# EasyEDA Pro project PY32单片机版电池內阻测试仪.eprj, schematic PY32单片机版电池內阻测试仪
Create Date: 2023-05-11; Page Name: PY32单片机版电池內阻测试仪; Project Name: PY32单片机版电池內阻测试仪; Schematic Name: PY32单片机版电池內阻测试仪; Update Date: 2023-08-15; Company: 嘉立创EDA; Page Size: A4; Version: V1.0
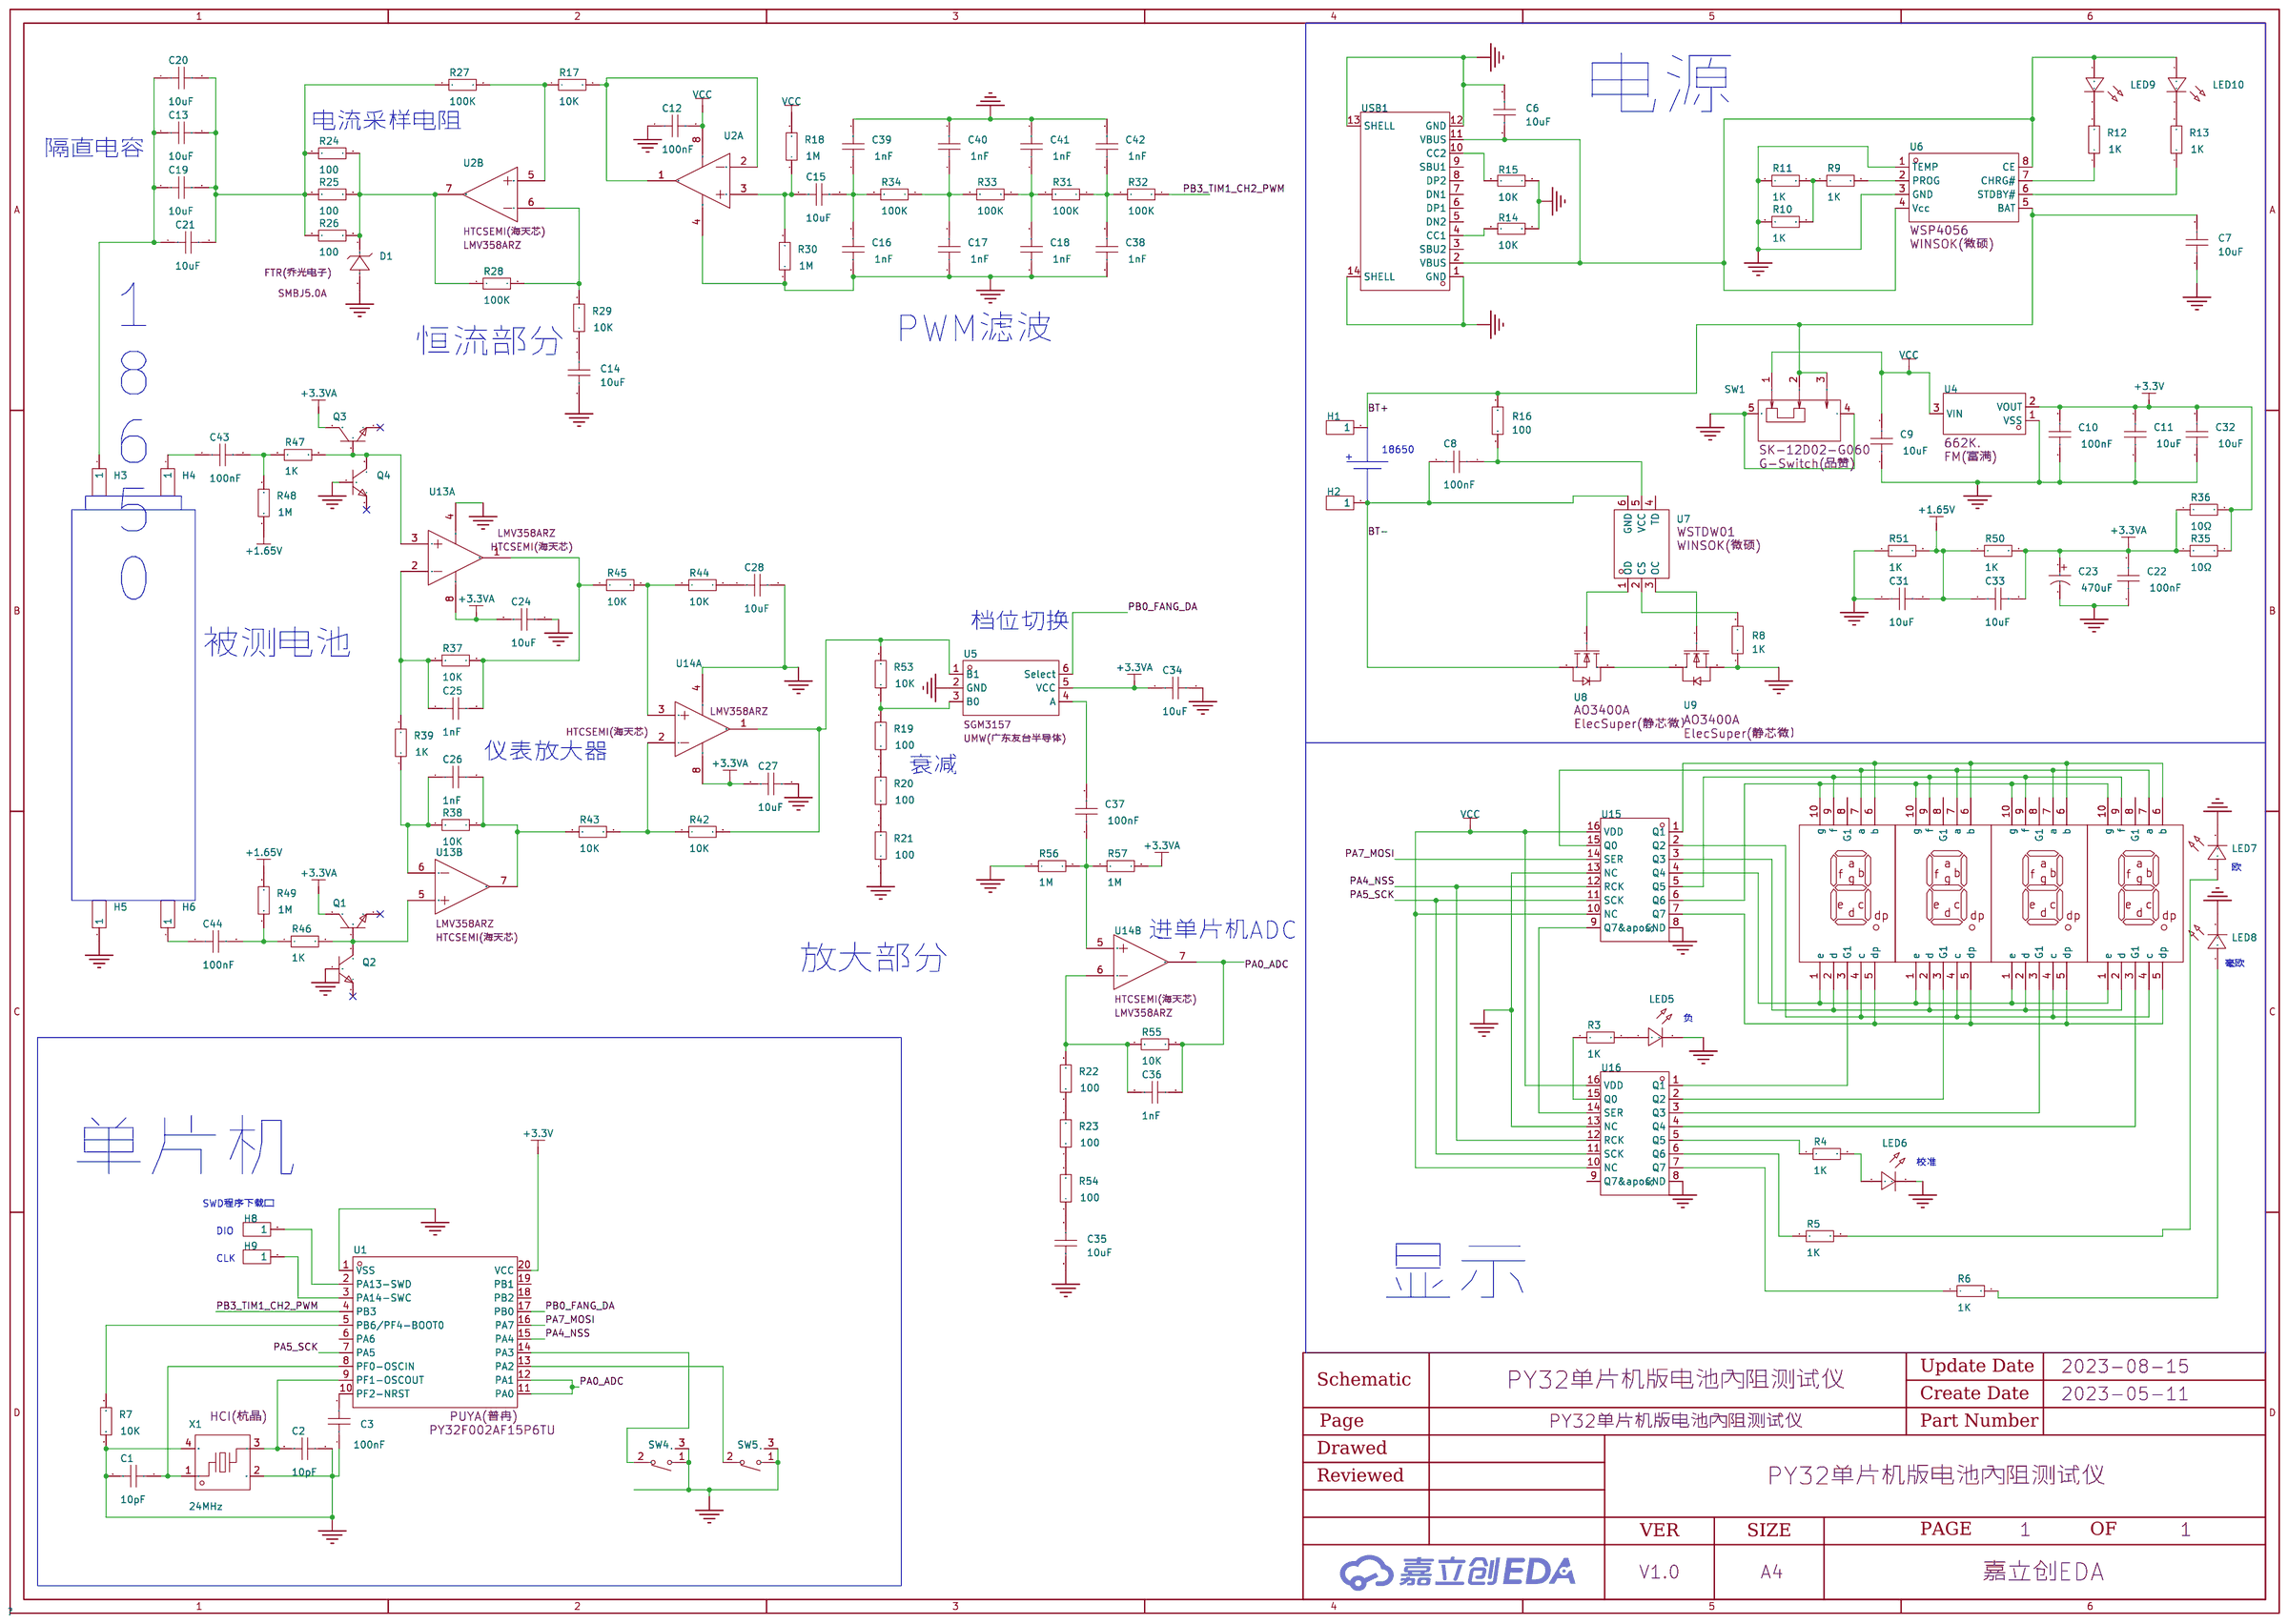
[diagram p0: schematic sheet]

## Parts
C1  10pF  [C0603]
C2  10pF  [C0603]
C3  100nF  [C0603]
C6  10uF  [C0603]
C7  10uF  [C0603]
C8  100nF  [C0603]
C9  10uF  [C0603]
C10  100nF  [C0603]
C11  10uF  [C0603]
C12  100nF  [C0603]
C13  10uF  [C0603]
C14  10uF  [C0603]
C15  10uF  [C0603]
C16  1nF  [C0603]
C17  1nF  [C0603]
C18  1nF  [C0603]
C19  10uF  [C0603]
C20  10uF  [C0603]
C21  10uF  [C0603]
C22  100nF  [C0603]
C23  470uF  [CAP-TH_BD8.0-P3.50-D0.6-FD]
C24  10uF  [C0603]
C25  1nF  [C0603]
C26  1nF  [C0603]
C27  10uF  [C0603]
C28  10uF  [C0603]
C31  10uF  [C0603]
C32  10uF  [C0603]
C33  10uF  [C0603]
C34  10uF  [C0603]
C35  10uF  [C0603]
C36  1nF  [C0603]
C37  100nF  [C0603]
C38  1nF  [C0603]
C39  1nF  [C0603]
C40  1nF  [C0603]
C41  1nF  [C0603]
C42  1nF  [C0603]
C43  100nF  [C1206]
C44  100nF  [C1206]
D1  SMBJ5.0A  [SMB_L4.3-W3.6-LS5.3-RD]
H1  -  [HDR-TH_1P-V-M_XKB_X4611WV-01I-C28D40]
H2  -  [HDR-TH_1P-V-M_XKB_X4611WV-01I-C28D40]
H3  -  [HDR-TH_1P-V-M_XKB_X4611WV-01I-C28D40]
H4  -  [HDR-TH_1P-V-M_XKB_X4611WV-01I-C28D40]
H5  -  [HDR-TH_1P-V-M_XKB_X4611WV-01I-C28D40]
H6  -  [HDR-TH_1P-V-M_XKB_X4611WV-01I-C28D40]
H8  -  [HDR-TH_1P-V-M_XKB_X4611WV-01I-C28D40]
H9  -  [HDR-TH_1P-V-M_XKB_X4611WV-01I-C28D40]
LED5  -  [LED_TH-3mm]
LED6  -  [LED_TH-3mm]
LED7  -  [LED_TH-3mm]
LED8  -  [LED_TH-3mm]
LED9  -  [LED_TH-3mm]
LED10  -  [LED_TH-3mm]
LED11  SM410561N  [LED-SEG-TH_10P-L12.7-W19.0-P2.54-S15.24-BL]
LED12  SM410561N  [LED-SEG-TH_10P-L12.7-W19.0-P2.54-S15.24-BL]
LED13  SM410561N  [LED-SEG-TH_10P-L12.7-W19.0-P2.54-S15.24-BL]
LED14  SM410561N  [LED-SEG-TH_10P-L12.7-W19.0-P2.54-S15.24-BL]
Q1  SS8050  [SOT-23-3_L2.9-W1.3-P1.90-LS2.4-BR]
Q2  SS8050  [SOT-23-3_L2.9-W1.3-P1.90-LS2.4-BR]
Q3  SS8050  [SOT-23-3_L2.9-W1.3-P1.90-LS2.4-BR]
Q4  SS8050  [SOT-23-3_L2.9-W1.3-P1.90-LS2.4-BR]
R3  1K  [R0603]
R4  1K  [R0603]
R5  1K  [R0603]
R6  1K  [R0603]
R7  10K  [R0603]
R8  1K  [R0603]
R9  1K  [R0603]
R10  1K  [R0603]
R11  1K  [R0603]
R12  1K  [R0603]
R13  1K  [R0603]
R14  10K  [R0603]
R15  10K  [R0603]
R16  100  [R0603]
R17  10K  [R0603]
R18  1M  [R0603]
R19  100  [R0603]
R20  100  [R0603]
R21  100  [R0603]
R22  100  [R0603]
R23  100  [R0603]
R24  100  [R0603]
R25  100  [R0603]
R26  100  [R0603]
R27  100K  [R0603]
R28  100K  [R0603]
R29  10K  [R0603]
R30  1M  [R0603]
R31  100K  [R0603]
R32  100K  [R0603]
R33  100K  [R0603]
R34  100K  [R0603]
R35  10Ω  [R0603]
R36  10Ω  [R0603]
R37  10K  [R0603]
R38  10K  [R0603]
R39  1K  [R0603]
R42  10K  [R0603]
R43  10K  [R0603]
R44  10K  [R0603]
R45  10K  [R0603]
R46  1K  [R0603]
R47  1K  [R0603]
R48  1M  [R0603]
R49  1M  [R0603]
R50  1K  [R0603]
R51  1K  [R0603]
R53  10K  [R0603]
R54  100  [R0603]
R55  10K  [R0603]
R56  1M  [R0603]
R57  1M  [R0603]
SW1  SK-12D02-G060  [SW-TH_SK-12D02-G060]
SW4  HX TS4538B3J 250gf  [SW-TH_TS4538B3J]
SW5  HX TS4538B3J 250gf  [SW-TH_TS4538B3J]
U1  PY32F002AF15P6TU  [TSSOP-20_L6.5-W4.4-P0.65-LS6.4-BL]
U2  LMV358ARZ  [SOP-8_L4.9-W3.9-P1.27-LS6.0-BL]  (sections 1,2)
U4  662K.  [SOT-23-3_L2.9-W1.3-P1.90-LS2.4-BR]
U5  SGM3157  [SC-70-6_L2.2-W1.3-P0.65-LS2.1-BL]
U6  WSP4056  [SOP-8_L5.1-W3.9-P1.27-LS6.0-BL]
U7  WSTDW01  [SOT-23-6_L2.9-W1.6-P0.95-LS2.8-BR]
U8  AO3400A  [SOT-23-3_L3.0-W1.6-P1.90-LS2.8-BR]
U9  AO3400A  [SOT-23-3_L3.0-W1.6-P1.90-LS2.8-BR]
U13  LMV358ARZ  [SOP-8_L4.9-W3.9-P1.27-LS6.0-BL]  (sections 1,2)
U14  LMV358ARZ  [SOP-8_L4.9-W3.9-P1.27-LS6.0-BL]  (sections 1,2)
U15  74HC595D.  [SOP-16_L9.9-W3.9-P1.27-LS6.0-BL]
U16  74HC595D.  [SOP-16_L9.9-W3.9-P1.27-LS6.0-BL]
USB1  TYPE-C 16PIN 2MD(073)  [USB-C-SMD_TYPE-C-6PIN-2MD-073]
X1  24MHz  [CRYSTAL-SMD_4P-L3.2-W2.5-BL]

## Library data of the parts
C1-C3 C6-C22 C24-C28 C31-C42 = CAP_0603: Supplier Footprint: 0603
C23 = KM477M016F12RR0VH2FP0: 容值:470uF;精度:±20%;额定电压:16V;; LCSC Part Name: 470uF ±20% 16V; Supplier Part: C28067; Manufacturer: CX(承兴); Supplier Footprint: 插件,D8xL12mm; JLCPCB Part Class: Extended Part; Datasheet: https://atta.szlcsc.com/upload/public/pdf/source/20211027/06D6BA3719C264B639DC286D935D03EA.pdf; Supplier: LCSC; Tolerance: ±20%; Rated Voltage: 16V; φD: 8mm; L: 12mm; Lead Spacing: 3.5mm; Lifetime @ Temp: 2000hrs@105℃
C43 C44 = FM31X104K451EEG: 容值:100nF;精度:±10%;额定电压:450V;材质(温度系数):X7R;; LCSC Part Name: 100nF ±10% 450V; Supplier Part: C784091; Manufacturer: PSA(信昌电陶); Supplier Footprint: 1206; JLCPCB Part Class: Extended Part; Datasheet: https://atta.szlcsc.com/upload/public/pdf/source/20191129/C464973_650D2E1C0337226551311C911F3C07C2.pdf; Supplier: LCSC; Tolerance: ±10%; Voltage Rated: 450V; Temperature Coefficient: X7R
D1 = SMBJ5.0A_C693503: 极性:单向;反向截止电压(Vrwm):5V;击穿电压(最小值):6.4V;峰值脉冲电流(Ipp)@10/1000s:65.3A;最大钳位电压:9.2V;; LCSC Part Name: 单向 5V; Supplier Part: C693503; Manufacturer: FTR(乔光电子); Supplier Footprint: SMB(DO-214AA); JLCPCB Part Class: Extended Part; Datasheet: https://atta.szlcsc.com/upload/public/pdf/source/20200701/C693490_2A1922FF33BB98835C22E740F3EF18EC.pdf; Supplier: LCSC; Polarity: 单向; Reverse Stand-Off Voltage (Vrwm): 5V; Breakdown Voltage (Min): 6.4V; Peak Pulse Current (Ipp)@10/1000μs: 65.3A; Maximum Clamping Voltage: 9.2V
H1-H6 H8 H9 = HDR-M_2.54_1x1P: Supplier Part: C81276; Supplier Footprint: 插件; JLCPCB Part Class: Extended Part
LED5-LED10 = LED_TH-R_3mm: Supplier Footprint: 插件
LED11-LED14 = SM410561N: 数码管位数:1;数字/字母大小(英寸):0.56;LED极性:共阳;发光颜色:红色;; Supplier Part: C141368; Manufacturer: ARKLED(方舟); Supplier Footprint: 插件; JLCPCB Part Class: Extended Part; Datasheet: https://atta.szlcsc.com/upload/public/pdf/source/20171116/C141368_15108221487951123771.pdf; Supplier: LCSC; Number of Characters: 1; Digit/Alpha Size(inch): 0.56; LED Polarity: 共阳; Luminous Color: 红色
Q1-Q4 = SS8050_C5249676: Polarity NPN 耗散功率(W) 0.3 最大集电极电流(mA) 1500 集电极-基极电压（V） 40 饱和压降（V） 0.5 集电极/基极电流（mA） 800/80 最大工作频率(MHz) 100; Supplier Part: C5249676; Manufacturer: ElecSuper(静芯微）; Supplier Footprint: SOT-23; JLCPCB Part Class: Extended Part; Datasheet: https://atta.szlcsc.com/upload/public/pdf/source/20221109/25143ABAE3EF3AA2633DA047E92DED74.pdf; Supplier: LCSC
R3-R39 R42-R51 R53-R57 = Res_0603: Supplier Footprint: 0603
SW1 = SK-12D02-G060: 额定电流(DC):1A;额定电压(DC):24V;电路结构:单刀双掷;安装方式:卧插;机械寿命:1万次;开关颜色:黑色;; LCSC Part Name: 柄长6mm 卧插两档 滑动开关; Supplier Part: C2848884; Manufacturer: G-Switch(品赞); Supplier Footprint: 插件; JLCPCB Part Class: Extended Part; Datasheet: https://atta.szlcsc.com/upload/public/pdf/source/20210728/C2848884_C5B755598AC53A35BC19ACF540C1E5A5.pdf; Supplier: LCSC; Current Rating (DC): 1A; Voltage Rating (DC): 24V; Circuit: 单刀双掷; Mounting Style: 卧插; Mechanical Life: 1万次; Actuator Color: 黑色; Actuator Style: 矩形柱状; Pin Style: PC引脚; Operating Temperature: -25℃~+70℃; Switch Length: 8.6mm; Switch Width: 4.5mm; Switch Height: 10.5mm
SW4 SW5 = HX TS4538B3J 250gf: 机械寿命:-;; LCSC Part Name: 4.5*4.5*3.8mm 插件 轻触开关 不锈钢弹片 边三脚; Supplier Part: C5143652; Manufacturer: hanxia(韩下); Supplier Footprint: 插件; Datasheet: https://atta.szlcsc.com/upload/public/pdf/source/20220824/7E1C713E0EBD99A324597FCD97A4D2CF.pdf; Supplier: LCSC; Switch Length: 4.5mm; Switch Width: 4.5mm; Switch Height: 3.8mm
U1 = PY32F002AF15P6TU: LCSC Part Name: 32位微控制器 单片机  PY32F002AF15P6TU; Supplier Part: C5292059; Manufacturer: PUYA(普冉); Supplier Footprint: TSSOP-20; JLCPCB Part Class: Extended Part; Datasheet: https://atta.szlcsc.com/upload/public/pdf/source/20230327/672347329C675A87241B0153A51AEBC2.pdf; Supplier: LCSC
U2 U13 U14 = LMV358ARZ: CMOS低功耗双路运算放大器; Supplier Part: C2928823; Manufacturer: HTCSEMI(海天芯); Supplier Footprint: SOP-8; JLCPCB Part Class: Extended Part; Datasheet: https://atta.szlcsc.com/upload/public/pdf/source/20220114/2D4B849A76DE33264688A93B3A90A0F8.pdf; Supplier: LCSC
U4 = 662K.: 输出类型:-;; LCSC Part Name: 662K; Supplier Part: C841298; Manufacturer: FM(富满); Supplier Footprint: SOT23-3; JLCPCB Part Class: Extended Part; Datasheet: https://atta.szlcsc.com/upload/public/pdf/watermark/20200922/C841298_3E220732626B158CD6AC195AF78C7FB8.pdf; Supplier: LCSC
U5 = SGM3157: 开关电路:-;; LCSC Part Name: 二选一模拟开关电路; Supplier Part: C394901; Manufacturer: UMW(广东友台半导体); Supplier Footprint: SC-70-6; JLCPCB Part Class: Extended Part; Datasheet: https://atta.szlcsc.com/upload/public/pdf/source/20220825/163C0318ED3C3969CBD04552300499AD.pdf; Supplier: LCSC
U6 = WSP4056: Supplier Part: C2985892; Manufacturer: WINSOK(微硕); Supplier Footprint: SOP-8; JLCPCB Part Class: Extended Part; Supplier: LCSC
U7 = WSTDW01: 充电电池的类型:-;电池单元组数:-;最大充电电流:-;充满的电池组电压:-;最大供应电压:-;; Supplier Part: C86873; Manufacturer: WINSOK(微硕); Supplier Footprint: SOT-23-6; JLCPCB Part Class: Extended Part; Datasheet: https://atta.szlcsc.com/upload/public/pdf/source/20161110/1478743415995.pdf; Supplier: LCSC
U8 U9 = AO3400A_C5224194: 类型:N沟道;漏源电压(Vdss):30V;连续漏极电流(Id):6A;功率(Pd):1.4W;导通电阻(RDS(on)@Vgs,Id):19mΩ@10V,6.0A;; LCSC Part Name: N沟道 30V 6A; Supplier Part: C5224194; Manufacturer: ElecSuper(静芯微）; Supplier Footprint: SOT-23-3L; JLCPCB Part Class: Extended Part; Datasheet: https://atta.szlcsc.com/upload/public/pdf/source/20221027/D95D9171DDBB7BB324532F3AF1EADB7E.pdf; Supplier: LCSC; Type: N沟道; Drain Source Voltage (Vdss): 30V; Continuous Drain Current (Id): 6A; Power Dissipation (Pd): 1.4W; Drain Source On Resistance (RDS(on)@Vgs,Id): 19mΩ@10V,6.0A; Gate Threshold Voltage (Vgs(th)@Id): 1V@250uA
U15 U16 = 74HC595D.: Supplier Part: C2929943; Manufacturer: FM(富满); Supplier Footprint: SOP-16; JLCPCB Part Class: Extended Part; Datasheet: https://atta.szlcsc.com/upload/public/pdf/source/20211125/20F1E3849D7C8A7DB346B0C433D530E9.pdf; Supplier: LCSC
USB1 = TYPE-C 16PIN 2MD(073): 连接器类型:Type-C;标准:-;公母:母座;触点数量:16;端口数量:1;安装方式:卧贴;额定电流 - 电源:5A;工作温度范围:-25℃~+85℃;; LCSC Part Name: TYPE-C母座 16P 4脚插件带定位柱 不锈钢外壳 2次模顶; Supplier Part: C2765186; Manufacturer: SHOU HAN(首韩); Supplier Footprint: SMD; JLCPCB Part Class: Extended Part; Datasheet: https://atta.szlcsc.com/upload/public/pdf/source/20211123/39B17C16241EAC15C5E277BDA434118E.pdf; Supplier: LCSC; Connector Type: Type-C; Gender: 母座; Number of Contacts: 16; Number of Ports: 1; Mounting Style: 卧贴; Current Rating - Power (Max): 5A; Operating Temperature Range: -25℃~+85℃
X1 = XC32M4-24.000-F12NJDTL: 频率:24MHz;频率公差:±10ppm;频率稳定度:±30ppm;负载电容:12pF;; Supplier Part: C5122304; Manufacturer: HCI(杭晶); Supplier Footprint: SMD3225-4P; JLCPCB Part Class: Extended Part; Datasheet: https://atta.szlcsc.com/upload/public/pdf/source/20220525/43C7A5B871DF4E364F96CDE8B1430A73.pdf; Supplier: LCSC; Frequency Tolerance: ±10ppm; Frequency Stability: ±30ppm; Load Capacitance: 12pF; Equivalent Series Resistance (ESR): 50Ω; Operating Temperature: -40℃~+85℃

## Nets
+1.65V: C31.2 C33.1 R48.1 R49.2 R50.1 R51.2
+3.3V: C10.2 C11.2 C32.2 R35.2 R36.2 U1.20(VCC) U4.2(VOUT)
+3.3VA: C22.2 C23.1 C24.2 C27.1 C33.2 C34.1 Q1.3(C) Q3.3(C) R35.1 R36.1 R50.2 R57.2 U5.5(VCC) U13.8(VCC) U14.8(VCC)
GND: C1.2 C2.1 C3.1 C6.2 C7.1 C9.1 C10.1 C11.1 C12.1 C14.1 C16.1 C17.1 C18.1 C22.1 C23.2 C24.1 C27.2 C28.2 C31.1 C32.1 C34.2 C35.1 C38.1 C39.2 C40.2 C41.2 C42.2 D1.2(A) H5.1 LED5.2(A) LED6.2(A) LED7.2(A) LED8.2(A) Q2.1(B) Q4.1(B) R7.1 R8.1 R10.1 R11.1 R14.1 R15.1 R21.1 R30.1 R51.1 R56.1 SW1.4 SW1.5 SW4.1 SW4.3 SW5.1 SW5.3 U1.1(VSS) U2.4(GND) U4.1(VSS) U5.2(GND) U6.1(TEMP) U6.3(GND) U9.2(S) U13.4(GND) U14.4(GND) U15.8(GND) U15.13(NC) U16.8(GND) U16.13(NC) USB1.1(GND) USB1.12(GND) USB1.13(SHELL) USB1.14(SHELL) X1.2(GND) X1.4(GND)
VCC: C9.2 C12.2 R18.2 SW1.1 U2.8(VCC) U4.3(VIN) U15.10(NC) U15.16(VDD) U16.10(NC) U16.16(VDD)
BT+: C7.2 H1.1 R16.2 SW1.2 SW1.3 U6.5(BAT)
BT-: C8.2 H2.1 U7.6(GND) U8.2(S)
PA0_ADC: C36.2 R55.2 U1.11(PA0) U1.12(PA1) U14.7(OUT2)
PA4_NSS: U1.15(PA4) U15.12(RCK) U16.12(RCK)
PA5_SCK: U1.7(PA5) U15.11(SCK) U16.11(SCK)
PA7_MOSI: U1.16(PA7) U15.14(SER)
PB0_FANG_DA: U1.17(PB0) U5.6(Select)
PB3_TIM1_CH2_PWM: R32.1 U1.4(PB3)
$1N3675: LED11.10(g) LED12.10(g) LED13.10(g) LED14.10(g) U15.6(Q6)
$1N3680: LED11.9(f) LED12.9(f) LED13.9(f) LED14.9(f) U15.5(Q5)
$1N6685: LED6.1(C) R4.2
$1N6896: LED7.1(C) R5.2
$1N6922: LED8.1(C) R6.2
$1N7000: R4.1 U16.5(Q5)
$1N7028: R5.1 U16.6(Q6)
$1N7057: R6.1 U16.7(Q7)
$1N8069: U15.9(Q7&apos;) U16.14(SER)
$1N8265: LED5.1(C) R3.2
$1N8293: R3.1 U16.15(Q0)
$1N8810: LED11.1(e) LED12.1(e) LED13.1(e) LED14.1(e) U15.4(Q4)
$1N8839: LED11.2(d) LED12.2(d) LED13.2(d) LED14.2(d) U15.3(Q3)
$1N8868: LED11.4(c) LED12.4(c) LED13.4(c) LED14.4(c) U15.2(Q2)
$1N8897: LED11.5(dp) LED12.5(dp) LED13.5(dp) LED14.5(dp) U15.7(Q7)
$1N9196: LED11.6(b) LED12.6(b) LED13.6(b) LED14.6(b) U15.1(Q1)
$1N9408: LED11.7(a) LED12.7(a) LED13.7(a) LED14.7(a) U15.15(Q0)
$1N11543: C1.1 U1.8(PF0-OSCIN) X1.1
$1N11575: C2.2 U1.9(PF1-OSCOUT) X1.3
$1N11831: C3.2 U1.10(PF2-NRST)
$1N12390: R7.2 U1.5(PB6/PF4-BOOT0)
$1N13187: H8.1 U1.2(PA13-SWD)
$1N13230: H9.1 U1.3(PA14-SWC)
$1N13991: U8.3(D) U9.3(D)
$1N14154: U7.1(OD) U8.1(G)
$1N14198: U7.3(OC) U9.1(G)
$1N14351: R8.2 U7.2(CS)
$1N14884: R9.1 R10.2 R11.2
$1N15015: R9.2 U6.2(PROG)
$1N15682: LED9.2(A) R12.2
$1N15797: LED10.2(A) R13.2
$1N15845: R12.1 U6.7(CHRG#)
$1N15894: R13.1 U6.6(STDBY#)
$1N16826: R14.2 USB1.4(CC1)
$1N16875: R15.2 USB1.10(CC2)
$1N17421: C6.1 LED9.1(C) LED10.1(C) U6.4(Vcc) U6.8(CE) USB1.2(VBUS) USB1.11(VBUS)
$1N19532: C8.1 R16.1 U7.5(VCC)
$1N29722: C13.2 C19.2 C20.2 C21.2 R24.1 R25.1 R26.1 R27.1
$1N30545: R28.2 R29.2 U2.6(IN2-)
$1N31466: R17.1 R27.2 U2.5(IN2+)
$1N35483: D1.1(C) R24.2 R25.2 R26.2 R28.1 U2.7(OUT2)
$1N36571: R17.2 U2.1(OUT) U2.2(IN1-)
$1N41452: C17.2 C40.1 R33.2 R34.1
$1N41532: C15.2 C16.2 C39.1 R34.2
$1N41612: C15.1 R18.1 R30.2 U2.3(IN1+)
$1N44249: C13.1 C19.1 C20.1 C21.1 H3.1
$1N45108: C14.2 R29.1
$1N80691: C25.1 R37.1 R39.2 U13.2(IN1-)
$1N81427: C26.1 R38.1 R39.1 U13.6(IN2-)
$1N81532: C26.2 R38.2 R43.1 U13.7(OUT2)
$1N83998: C28.1 R44.2
$1N85039: R42.1 R43.2 U14.2(IN1-)
$1N86076: R44.1 R45.2 U14.3(IN1+)
$1N86077: C25.2 R37.2 R45.1 U13.1(OUT)
$1N94982: Q3.1(B) Q4.3(C) R47.2 U13.3(IN1+)
$1N95485: Q1.1(B) Q2.3(C) R46.2 U13.5(IN2+)
$1N97809: R19.1 R20.2
$1N97810: R20.1 R21.2
$1N99087: R19.2 R53.1 U5.3(B0)
$1N104717: R42.2 R53.2 U5.1(B1) U14.1(OUT)
$1N108179: R22.1 R23.2
$1N108180: R23.1 R54.2
$1N108784: C35.2 R54.1
$1N111292: C37.2 U5.4(A)
$1N135539: C38.2 C42.1 R31.1 R32.2
$1N135540: C18.2 C41.1 R31.2 R33.1
$1N150179: C37.1 R56.2 R57.1 U14.5(IN2+)
$1N150210: C36.1 R22.2 R55.1 U14.6(IN2-)
$1N150464: C43.1 H4.1
$1N150468: C43.2 R47.1 R48.2
$1N150580: C44.2 R46.1 R49.1
$1N150583: C44.1 H6.1
$1N158319: SW5.2 U1.13(PA2)
$1N158326: SW4.2 U1.14(PA3)
$1N165859: LED14.3(G1) U16.4(Q4)
$1N165862: LED13.3(G1) U16.3(Q3)
$1N165865: LED12.3(G1) U16.2(Q2)
$1N165868: LED11.3(G1) U16.1(Q1)

Not connected (* = marked no-connect by the designer): LED11 8(G1); LED12 8(G1); LED13 8(G1); LED14 8(G1); Q1 2(E)*; Q2 2(E)*; Q3 2(E)*; Q4 2(E)*; U1 6(PA6) 18(PB2) 19(PB1); U7 4(TD); U16 9(Q7&apos;); USB1 3(SBU2) 5(DN2) 6(DP1) 7(DN1) 8(DP2) 9(SBU1)

## Notes on the sheet
- 电源
- 电流采样电阻
- 隔直电容
- PWM滤波
- 恒流部分
- +
- 18650
- 1
  8
  6
  5
  0
- 档位切换
- 被测电池
- 仪表放大器
- 衰减
- 欧
- 进单片机ADC
- 毫欧
- 放大部分
- 负
- 单片机
- 校准
- SWD程序下载口
- DIO
- CLK
- 显示
